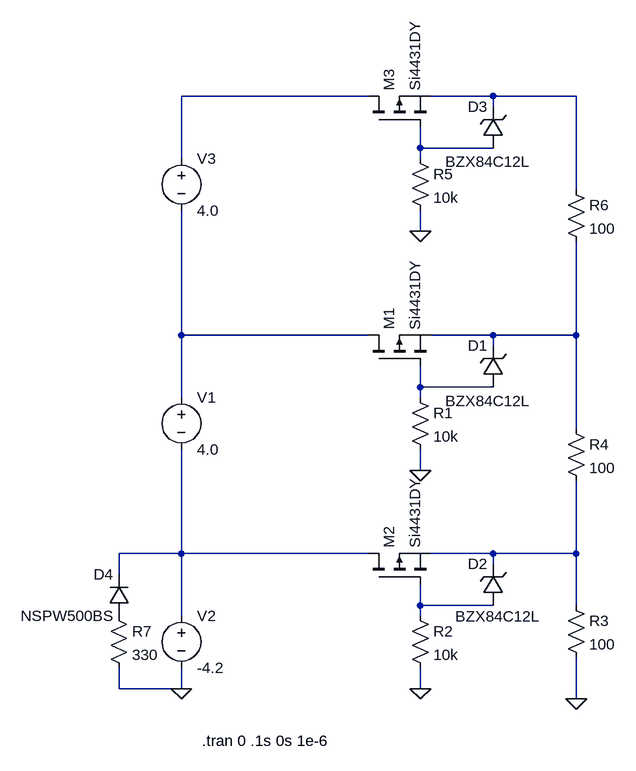
[diagram p0: schematic Reverse-polarity-protection.asc]
Reverse-polarity-protection.asc, the LTspice schematic file:
Version 4.1
SHEET 1 880 680
WIRE 272 -384 -16 -384
WIRE 464 -384 368 -384
WIRE 592 -384 464 -384
WIRE 464 -368 464 -384
WIRE 352 -304 352 -336
WIRE 464 -304 352 -304
WIRE -16 -288 -16 -384
WIRE 352 -288 352 -304
WIRE 592 -240 592 -384
WIRE 352 -176 352 -208
WIRE -16 -16 -16 -208
WIRE 272 -16 -16 -16
WIRE 464 -16 368 -16
WIRE 592 -16 592 -160
WIRE 592 -16 464 -16
WIRE 464 0 464 -16
WIRE 352 64 352 32
WIRE 464 64 352 64
WIRE -16 80 -16 -16
WIRE 352 80 352 64
WIRE 592 128 592 -16
WIRE 352 192 352 160
WIRE -16 320 -16 160
WIRE -16 320 -112 320
WIRE 272 320 -16 320
WIRE 464 320 368 320
WIRE 592 320 592 208
WIRE 592 320 464 320
WIRE 464 336 464 320
WIRE -112 352 -112 320
WIRE 352 400 352 368
WIRE 464 400 352 400
WIRE 592 400 592 320
WIRE -16 416 -16 320
WIRE 352 416 352 400
WIRE -112 528 -112 496
WIRE -16 528 -16 496
WIRE -16 528 -112 528
WIRE 352 528 352 496
WIRE 592 544 592 480
FLAG 352 192 0
FLAG 592 544 0
FLAG 352 528 0
FLAG 352 -176 0
FLAG -16 528 0
SYMBOL voltage -16 64 R0
WINDOW 123 0 0 Left 0
WINDOW 39 0 0 Left 0
SYMATTR InstName V1
SYMATTR Value 4.0
SYMBOL pmos 272 32 R270
SYMATTR InstName M1
SYMATTR Value Si4431DY
SYMBOL res 336 64 R0
SYMATTR InstName R1
SYMATTR Value 10k
SYMBOL zener 480 64 R180
WINDOW 0 24 64 Left 2
WINDOW 3 -42 -21 Left 2
SYMATTR InstName D1
SYMATTR Value BZX84C12L
SYMBOL voltage -16 400 R0
WINDOW 123 0 0 Left 0
WINDOW 39 0 0 Left 0
SYMATTR InstName V2
SYMATTR Value -4.2
SYMBOL pmos 272 368 R270
SYMATTR InstName M2
SYMATTR Value Si4431DY
SYMBOL res 336 400 R0
SYMATTR InstName R2
SYMATTR Value 10k
SYMBOL zener 480 400 R180
WINDOW 0 24 64 Left 2
WINDOW 3 -57 -17 Left 2
SYMATTR InstName D2
SYMATTR Value BZX84C12L
SYMBOL res 576 384 R0
SYMATTR InstName R3
SYMATTR Value 100
SYMBOL res 576 112 R0
SYMATTR InstName R4
SYMATTR Value 100
SYMBOL voltage -16 -304 R0
WINDOW 123 0 0 Left 0
WINDOW 39 0 0 Left 0
SYMATTR InstName V3
SYMATTR Value 4.0
SYMBOL pmos 272 -336 R270
SYMATTR InstName M3
SYMATTR Value Si4431DY
SYMBOL res 336 -304 R0
SYMATTR InstName R5
SYMATTR Value 10k
SYMBOL zener 480 -304 R180
WINDOW 0 24 64 Left 2
WINDOW 3 -42 -21 Left 2
SYMATTR InstName D3
SYMATTR Value BZX84C12L
SYMBOL res 576 -256 R0
SYMATTR InstName R6
SYMATTR Value 100
SYMBOL res -128 400 R0
SYMATTR InstName R7
SYMATTR Value 330
SYMBOL diode -96 416 R180
WINDOW 0 24 64 Left 2
WINDOW 3 24 0 Left 2
SYMATTR InstName D4
SYMATTR Value NSPW500BS
SYMATTR Description Diode
SYMATTR Type diode
TEXT 16 608 Left 2 !.tran 0 .1s 0s 1e-6

The netlist it stands for:
* Reverse-polarity-protection.asc
V1 N004 N007 4.0
M1 N004 N006 N005 N005 Si4431DY
R1 N006 0 10k
D1 N006 N005 BZX84C12L
V2 N007 0 -4.2
M2 N007 N009 N008 N008 Si4431DY
R2 N009 0 10k
D2 N009 N008 BZX84C12L
R3 N008 0 100
R4 N005 N008 100
V3 N001 N004 4.0
M3 N001 N003 N002 N002 Si4431DY
R5 N003 0 10k
D3 N003 N002 BZX84C12L
R6 N002 N005 100
R7 P001 0 330
D4 P001 N007 NSPW500BS
.model D D
.lib standard.dio
.model NMOS NMOS
.model PMOS PMOS
.lib standard.mos
.tran 0 .1s 0s 1e-6
.backanno
.end